# Altium schematic sheet SLAVE.SchDoc
size A
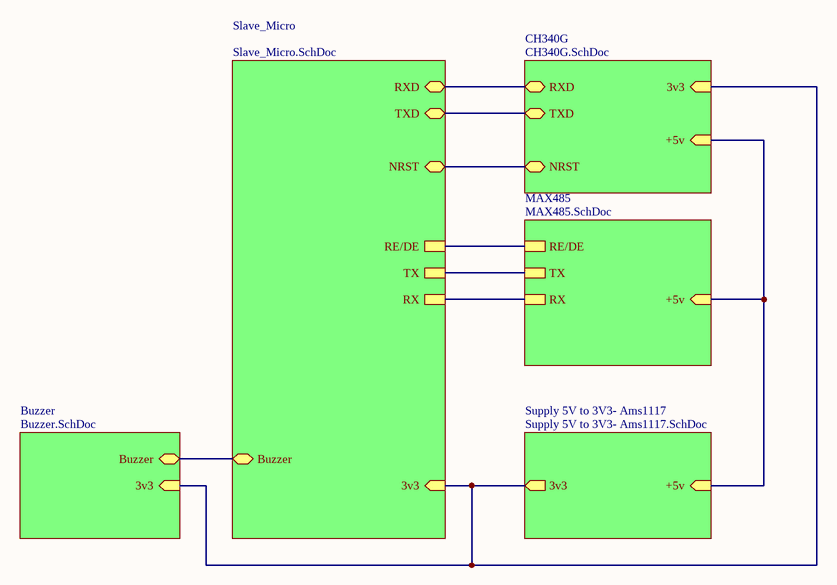
[diagram p0: SLAVE.SchDoc]

## Sub-sheets
Buzzer = Buzzer.SchDoc: 3v3 (in), Buzzer (bidir)
CH340G = CH340G.SchDoc: +5v (in), RXD (bidir), TXD (bidir), NRST (bidir), 3v3 (in)
MAX485 = MAX485.SchDoc: +5v (in), RE/DE, TX, RX
Slave_Micro = Slave_Micro.SchDoc: NRST (bidir), 3v3 (in), TX, RX, RE/DE, RXD (bidir), TXD (bidir), Buzzer (bidir)
Supply 5V to 3V3- Ams1117 = Supply 5V to 3V3- Ams1117.SchDoc: +5v (in), 3v3 (out)

## Nets
(unnamed): sheet Slave_Micro/NRST, sheet CH340G/NRST
(unnamed): sheet Slave_Micro/3v3, sheet Supply 5V to 3V3- Ams1117/3v3, sheet CH340G/3v3, sheet Buzzer/3v3
(unnamed): sheet Slave_Micro/TX, sheet MAX485/TX
(unnamed): sheet Slave_Micro/RX, sheet MAX485/RX
(unnamed): sheet Slave_Micro/RE/DE, sheet MAX485/RE/DE
(unnamed): sheet Slave_Micro/RXD, sheet CH340G/RXD
(unnamed): sheet Slave_Micro/TXD, sheet CH340G/TXD
(unnamed): sheet Slave_Micro/Buzzer, sheet Buzzer/Buzzer
(unnamed): sheet Supply 5V to 3V3- Ams1117/+5v, sheet CH340G/+5v, sheet MAX485/+5v